# Altium schematic sheet FPGA_PWR.SchDoc
size A3
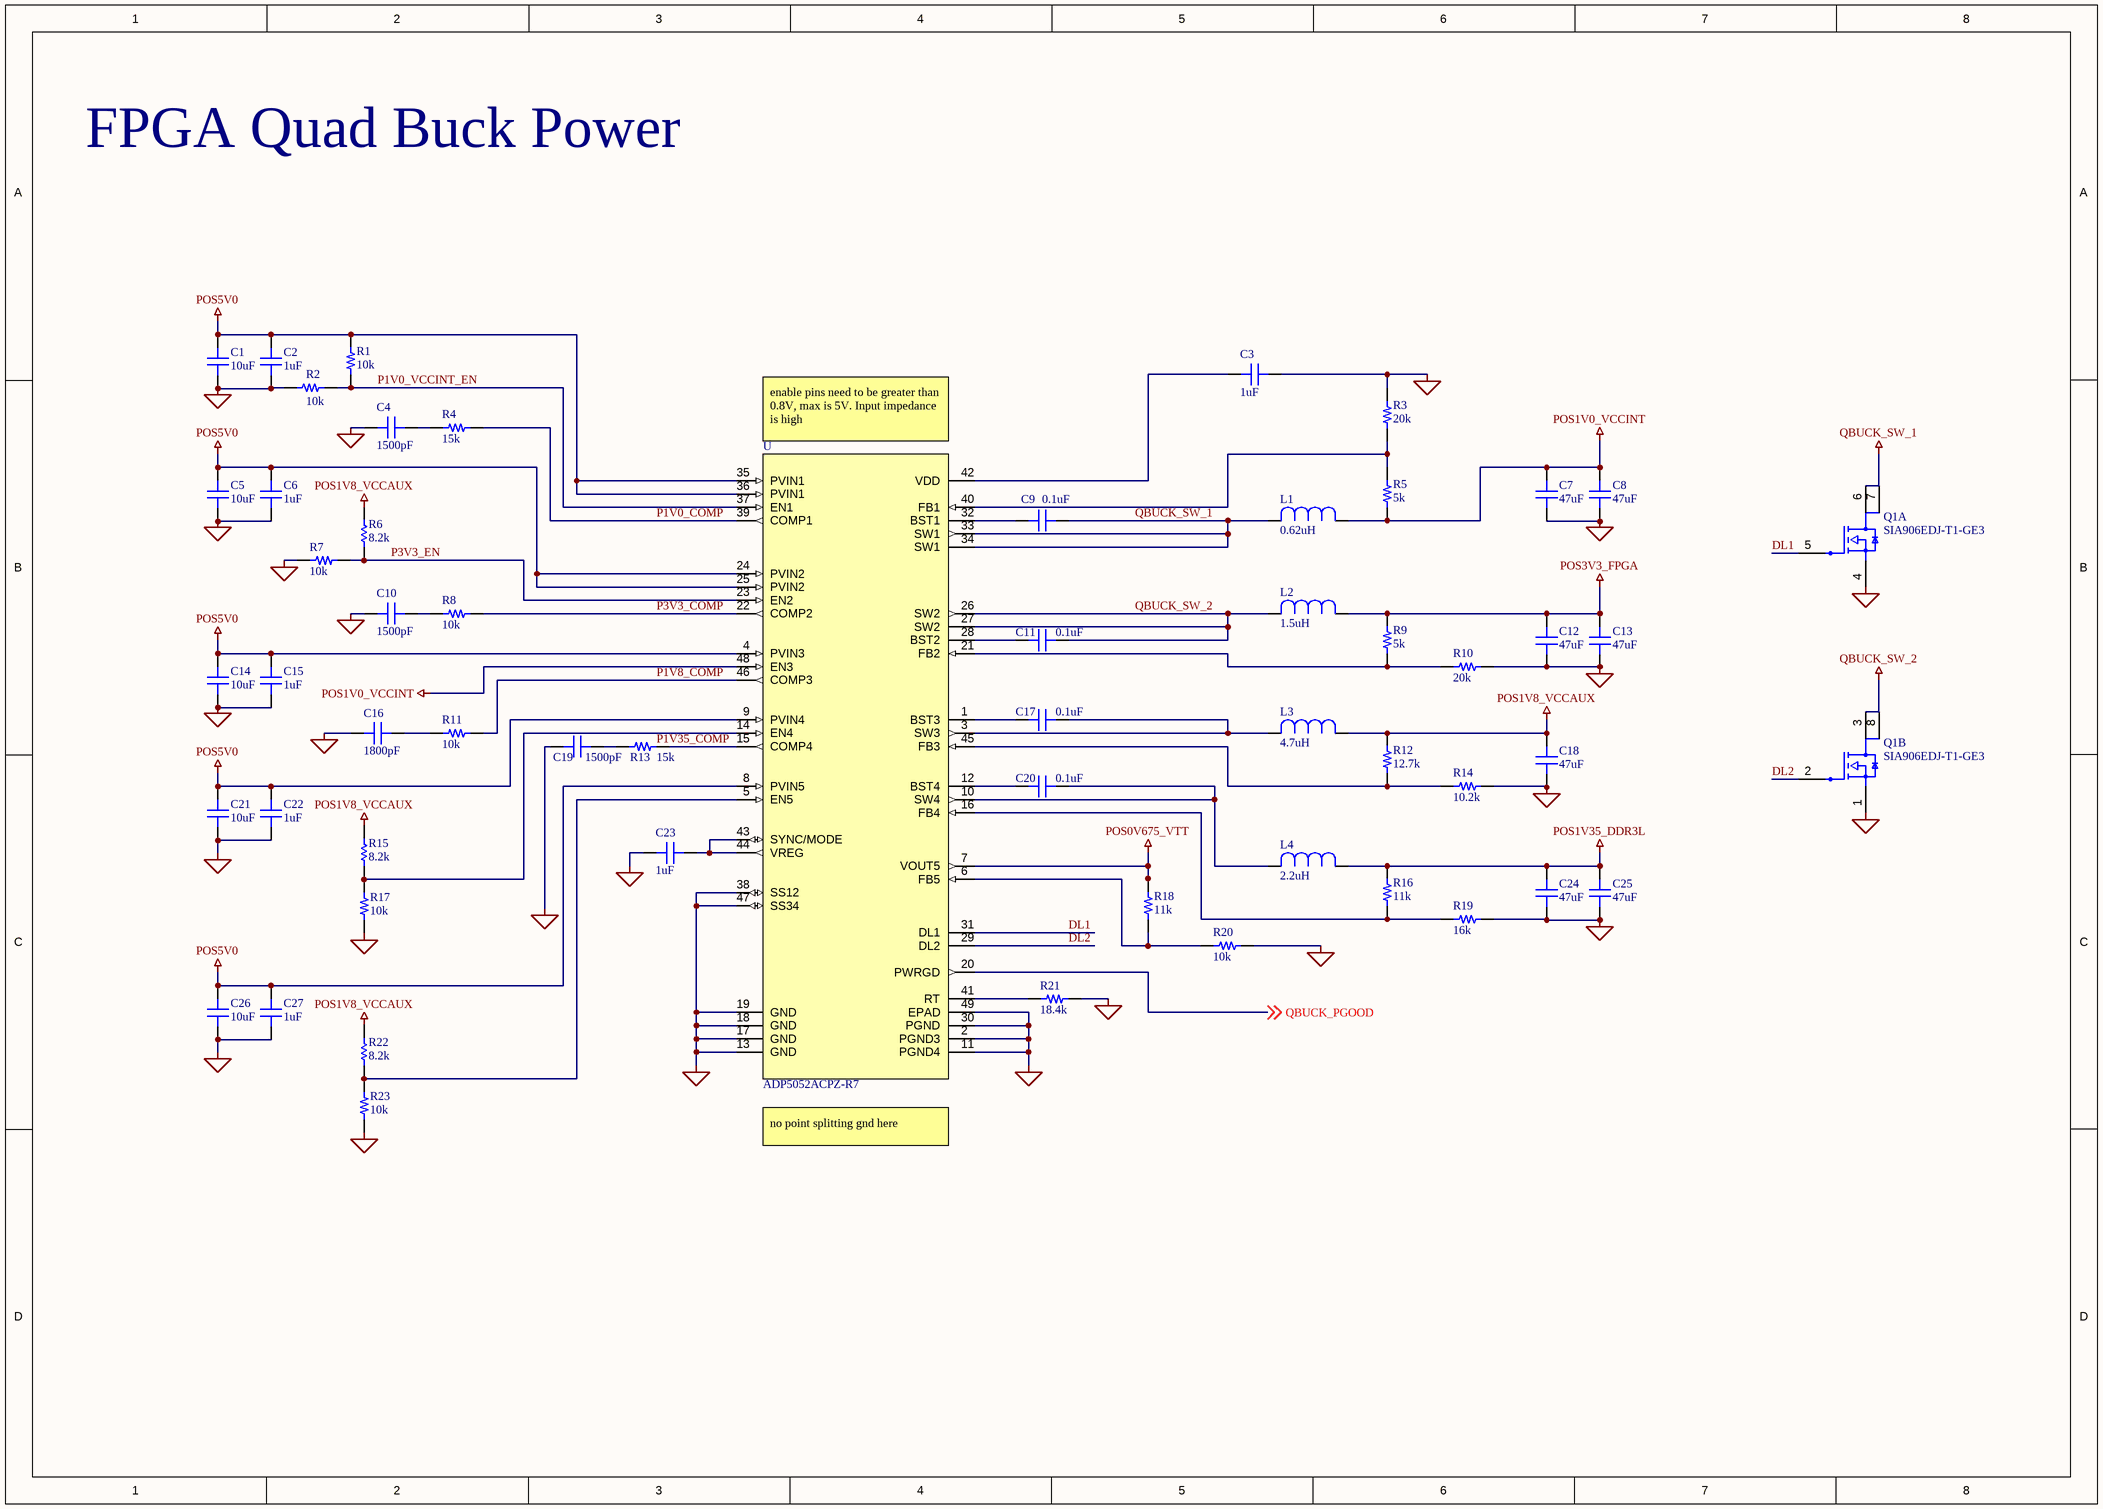
[diagram p0: FPGA_PWR.SchDoc]

## Parts
C1  10uF  [FP-GRM155-0_05-IPC_A]
C2  1uF  [FP-GRM155-0_05-IPC_A]
C3  1uF  [FP-GRM155-0_05-IPC_A]
C4  1500pF  [FP-GRM155-0_05-IPC_A]
C5  10uF  [FP-GRM155-0_05-IPC_A]
C6  1uF  [FP-GRM155-0_05-IPC_A]
C7  47uF  [FP-GCJ21B-0_3-IPC_A]
C8  47uF  [FP-GCJ21B-0_3-IPC_A]
C9  0.1uF  [FP-GRM155-0_05-IPC_A]
C10  1500pF  [FP-GRM155-0_05-IPC_A]
C11  0.1uF  [FP-GRM155-0_05-IPC_A]
C12  47uF  [FP-GCJ21B-0_3-IPC_A]
C13  47uF  [FP-GCJ21B-0_3-IPC_A]
C14  10uF  [FP-GRM155-0_05-IPC_A]
C15  1uF  [FP-GRM155-0_05-IPC_A]
C16  1800pF  [FP-GRM155-0_05-IPC_A]
C17  0.1uF  [FP-GRM155-0_05-IPC_A]
C18  47uF  [FP-GCJ21B-0_3-IPC_A]
C19  1500pF  [FP-GRM155-0_05-IPC_A]
C20  0.1uF  [FP-GRM155-0_05-IPC_A]
C21  10uF  [FP-GRM155-0_05-IPC_A]
C22  1uF  [FP-GRM155-0_05-IPC_A]
C23  1uF  [FP-GRM155-0_05-IPC_A]
C24  47uF  [FP-GCJ21B-0_3-IPC_A]
C25  47uF  [FP-GCJ21B-0_3-IPC_A]
C26  10uF  [FP-GRM155-0_05-IPC_A]
C27  1uF  [FP-GRM155-0_05-IPC_A]
L1  0.62uH  [IND_XGL4030_COC]
L2  1.5uH  [IND_XGL4030_COC]
L3  4.7uH  [IND_XGL4030_COC]
L4  2.2uH  [IND_XGL4030_COC]
Q1  SIA906EDJ-T1-GE3  [FP-C-07431-DUAL-MFG]  (parts A,B of 2)
R1  10k  [RES 0603_1608]
R2  10k  [RES 0603_1608]
R3  20k  [FP-RC0402-IPC_A]
R4  15k  [RES 0603_1608]
R5  5k  [FP-RC0402-IPC_A]
R6  8.2k  [RESC1609X55X30LL15T15]
R7  10k  [RES 0603_1608]
R8  10k  [RES 0603_1608]
R9  5k  [FP-RC0402-IPC_A]
R10  20k  [FP-RC0402-IPC_A]
R11  10k  [RES 0603_1608]
R12  12.7k  [FP-RC0402-IPC_A]
R13  15k  [RES 0603_1608]
R14  10.2k  [FP-RC0402-IPC_A]
R15  8.2k  [RESC1609X55X30LL15T15]
R16  11k  [FP-RC0402-IPC_A]
R17  10k  [RES 0603_1608]
R18  11k  [FP-RC0402-IPC_A]
R19  16k  [FP-RC0402-IPC_A]
R20  10k  [RES 0603_1608]
R21  18.4k  [RES 0603_1608]
R22  8.2k  [RESC1609X55X30LL15T15]
R23  10k  [RES 0603_1608]
U  ADP5052ACPZ-R7  [QFN50P700X700X80-49N]

## Nets
GND: C1.1 C2.1 C3.1 C4.2 C5.1 C6.1 C7.1 C8.1 C10.2 C12.1 C13.1 C14.1 C15.1 C16.2 C18.1 C19.2 C21.1 C22.1 C23.2 C24.1 C25.1 C26.1 C27.1 Q1.1(S1) Q1.4(S1) R2.2 R3.1 R7.2 R10.2 R14.2 R17.2 R19.2 R20.1 R21.1 R23.2 U.2(PGND3) U.11(PGND4) U.13(GND) U.17(GND) U.18(GND) U.19(GND) U.30(PGND) U.38(SS12) U.47(SS34) U.49(EPAD)
POS0V675_VTT: R18.2 U.7(VOUT5)
POS1V0_VCCINT: C7.2 C8.2 L1.1 R5.1 U.48(EN3)
POS1V8_VCCAUX: C18.2 L3.1 R12.2
POS1V35_DDR3L: C24.2 C25.2 L4.1 R16.2
POS3V3_FPGA: C12.2 C13.2 L2.1 R9.2
POS5V0: C1.2 C2.2 C5.2 C6.2 C14.2 C15.2 C21.2 C22.2 C26.2 C27.2 R1.2 U.4(PVIN3) U.8(PVIN5) U.9(PVIN4) U.24(PVIN2) U.25(PVIN2) U.35(PVIN1) U.36(PVIN1)
QBUCK_SW_1: C9.2 L1.2 Q1.6(D1) Q1.7(D1) U.33(SW1) U.34(SW1)
QBUCK_SW_2: C11.2 L2.2 Q1.3(D1) Q1.8(D1) U.26(SW2) U.27(SW2)
DL1: Q1.5(G1) U.31(DL1)
DL2: Q1.2(G1) U.29(DL2)
P1V0_COMP: R4.2 U.39(COMP1)
P1V0_VCCINT_EN: R1.1 R2.1 U.37(EN1)
P1V8_COMP: R11.1 U.46(COMP3)
P3V3_COMP: R8.1 U.22(COMP2)
P3V3_EN: R6.1 R7.1 U.23(EN2)
QBUCK_PGOOD: U.20(PWRGD) ; off-sheet QBUCK_PGOOD
NetC3_2: C3.2 U.42(VDD)
NetC4_1: C4.1 R4.1
NetC9_1: C9.1 U.32(BST1)
NetC10_1: C10.1 R8.2
NetC11_1: C11.1 U.28(BST2)
NetC16_1: C16.1 R11.2
NetC17_1: C17.1 U.1(BST3)
NetC17_2: C17.2 L3.2 U.3(SW3)
NetC19_1: C19.1 R13.1
NetC20_1: C20.1 U.12(BST4)
NetC20_2: C20.2 L4.2 U.10(SW4)
NetC23_1: C23.1 U.43(SYNC/MODE) U.44(VREG)
NetR3_2: R3.2 R5.2 U.40(FB1)
NetR9_1: R9.1 R10.1 U.21(FB2)
NetR12_1: R12.1 R14.1 U.45(FB3)
NetR13_2: R13.2 U.15(COMP4)
NetR15_1: R15.1 R17.1 U.14(EN4)
NetR16_1: R16.1 R19.1 U.16(FB4)
NetR18_1: R18.1 R20.2 U.6(FB5)
NetR21_2: R21.2 U.41(RT)
NetR22_1: R22.1 R23.1 U.5(EN5)

Not connected (* = marked no-connect by the designer): R6 2; R15 2; R22 2

## Notes on the sheet
- FPGA Quad Buck Power
- (near U) enable pins need to be greater than 0.8V, max is 5V. Input impedance is high
- no point splitting gnd here
- Labels drawn without touching a wire or pin: P1V35_COMP, POS1V8_VCCAUX
- THIS DOCUMENT AND THE DATA DISCLOSED HEREIN OR
- HEREWITH IS THE PROPERTY OF ALTIUM LIMITED AND MAY
- DWG NO:
- REVISION
- REV:
- DESCRIPTION
- DATE
- APPROVED
- BE FREELY DISTRIBUTED IN WHOLE. NO RIGHTS ARE
- RESERVED OR EXPRESS OR IMPLIED WARANTEE GIVEN.
- ENG:
- APPROVALS
- PROJECT
- DSN:
- CHK:
- REFERENCE DOCUMENTS
- PROJECT REVISION:
- TITLE
- DOCUMENT REVISION:
- DESIGN ITEM:
- BOM:
- FAB DWG:
- PCB DWG:
- ASSY DWG:
- SCALE:
- A3
- SIZE
- CAGE CODE
- FILE NAME
- DWG NO.
- SHEET
- OF
- REV

## Library data of the parts
C1 C4 C5 C10 C14 C16 C19 C21 C26 = CMP-13271-000002-1: CAP CER 10UF 10V X5R 0402; Manufacturer Part Number: CL05A106MP5NUNC; Manufacturer: Samsung; Temperature Coefficient: 15%; Tolerance: 20%; Material: Ceramic; Octopart: https://octopart.com/cl05a106mp5nunc-samsung-22457395; Voltage Rating: 10V; RoHS: TRUE; Value: 10uF; Height: 0.7mm; Digikey Description: CAP CER 10UF 10V X5R 0402; Automotive: No; Package: CL05A106MP5NUNC; Device Class L1: Passive Components; Capacitance: 10uF; Temperature Range High: +85°C; ComponentLink2Description: Datasheet; Device Class L2: Capacitors; Temperature Characteristic: X5R; Temperature: -55°C to +85°C; ComponentLink2URL: http://www.samsungsem.com/kr/support/product-search/mlcc/__icsFiles/afieldfile/2019/05/10/19-CL05A106MP5NUNC.pdf; Device Class L3: Ceramic Capacitors; Category: Cap; Temperature Range Low: -55°C; Ipc Land Pattern Name: CAPC10050X50; Lead Free: Yes
C2 C3 C6 C15 C22 C23 C27 = CMP-06035-012395-1: Chip Multilayer Ceramic Capacitors for General Purpose, 0402, 1.0uF, X5R, 15%, 20%, 25V; Weight: 0.000212oz; Dielectric: X5R; Case Code (Metric): 1005; Thickness: 0.022inch; Min Operating Temperature: -55°C; Voltage Rating (DC): 25V; Lead Free: Lead Free; Voltage Rating: 25V; Max Operating Temperature: 85°C; Case/Package: 0402; Packaging: Tape and Reel; Package Quantity: 10000; Termination: SMD/SMT; Height: 0.5mm; Width: 0.5mm; Mount: Surface Mount; Case Code (Imperial): 0402; Tolerance: 20%; Capacitance: 1uF; Length: 0.039inch
C7 C8 C12 C13 C18 C24 C25 = CMP-2007-03215-2: Multilayer Ceramic Capacitors MLCC - SMD/SMT 0805 0.47uF 10%, 50VDC,  X7R 15%; Voltage Rating (DC): 50V; Capacitance: 470nF; Case Code (Imperial): 0805; Tolerance: 10%; Length: 0.079inch; Packaging: Tape and Reel; Voltage Rating: 50V; Depth: 1.25mm; Lead Free: Lead Free; Features: Soft Termination; Min Operating Temperature: -55°C; Thickness: 0.057inch; Ratings: AEC-Q200; Case/Package: 0805; Dielectric: X7R; Case Code (Metric): 2012; Mount: Surface Mount; Termination: SMD/SMT; Width: 0.049inch; Max Operating Temperature: 125°C; Package Quantity: 3000
C9 C11 C17 C20 = CMP-06035-012395-1: Chip Multilayer Ceramic Capacitors for General Purpose, 0402, 1.0uF, X5R, 15%, 20%, 25V; Capacitance: 1uF; Weight: 0.000212oz; Dielectric: X5R; Case Code (Metric): 1005; Thickness: 0.022inch; Min Operating Temperature: -55°C; Voltage Rating (DC): 25V; Lead Free: Lead Free; Voltage Rating: 25V; Max Operating Temperature: 85°C; Case/Package: 0402; Packaging: Tape and Reel; Package Quantity: 10000; Termination: SMD/SMT; Height: 0.5mm; Width: 0.5mm; Mount: Surface Mount; Case Code (Imperial): 0402; Tolerance: 20%; Length: 0.039inch
L1-L4 = XGL4030-621MEC: No Description Available; Mfr_Name: Coilcraft
Q1 = CMP-02550-000163-1: MOSFET 2N-CH 20V 4.5A SC70-6; Manufacturer: Vishay; Transconductance: 14S; Rthja Max: 52°C/W; Turn On Delay Time: 5ns; Number Of Channels: 2; Threshold Vgs Max: 1.4V; Input Capacitace At Vds: 350pF @ 10V; Power Dissipation: 1.9W; Threshold Vgs Min: 0.6V; Drain To Source Resistance: 0.037Ω; Reverse Recovery Charge: 8nC; Depletion Mode: False; Turn Off Delay Time: 15ns; Gate Charge At Vgs: 7.5nC @ 10V; Typ Forward Diode Voltage: 0.8V; Gate To Source Voltage: 12V; Pulse Drain Current: 15A; Standoff Height: 0mm; Max Forward Diode Voltage: 1.2V; Max Junction Temp: +150°C; Temperature Range Low: -55°C; Manufacturer Part Number: SIA906EDJ-T1-GE3; Automotive: No; Digikey Description: MOSFET 2N-CH 20V 4.5A SC70-6; Drain To Source Voltage: 20V; Continuous Drain Current: 4.5A; Number Of N Channels: 2; Device Class L2: Transistors; Category: Trans; Footprint Url: https://www.vishay.com/docs/70487/70487.pdf; Device Class L3: MOSFETs; Package: C-07431-DUAL; Octopart: https://octopart.com/sia906edj-t1-ge3-vishay-44597396; ComponentLink2URL: https://www.vishay.com/docs/69067/sia906ed.pdf; Device Class L1: Discrete Semiconductors; Temperature Range High: +150°C; RoHS: TRUE; Reverse Recovery Time: 15ns; Drain To Source Breakdown Voltage: 20V; ComponentLink2Description: Datasheet; Lead Free: Yes; Mouser Description: MOSFET 20V 4.5A 7.8W 46mohm @ 4.5V; Height: 0.85mm; Temperature: -55°C to +150°C
R1 R2 R7 R8 R11 R17 R20 R23 = CMP-009-00190-14: 10 ±1% 0.1W, 1/10W Chip Resistor 0603 (1608 Metric) Automotive AEC-Q200 Thick Film; Power Rating: 100mW; Voltage Rating: 75V; Temperature Coefficient: 100ppm/°C; Tolerance: 1%; Resistance: 10k; Case/Package: 0603
R3 R10 = CMP-03412-013078-1: RES SMD 20K OHM 1% 1/16W 0402; Manufacturer: Yageo; Manufacturer Part Number: RC0402FR-075KL; Resistance: 5kΩ; Temperature Coefficient: 100ppm/°C; Power Rating: 0.0625W; Voltage Rating: 50V; Value: 5kΩ; Temperature Range Low: -55°C; Lead Free: Yes; RoHS: TRUE; Device Class L2: Resistors; Package: RC0402; Footprint Url: https://pccomponents.com/datasheets/YAGEO-20RESISTORS.PDF; Height: 0.4mm; ComponentLink2URL: http://www.yageo.com/documents/recent/PYu-RC_Group_51_RoHS_L_10.pdf; Temperature: -55°C to +155°C; Composition: Thick Film; Device Class L1: Passive Components; Series: RC_L; Ipc Land Pattern Name: RESC10050X35; Tolerance: 1%; Device Class L3: Chip SMD Resistors; Temperature Range High: +155°C; Category: Res; Automotive: No; Octopart: https://octopart.com/rc0402fr-075kl-yageo-25450038; Digikey Description: RES SMD 5K OHM 1% 1/16W 0402; ComponentLink2Description: Datasheet
R4 R13 = CMP-010-0035-11: 15 kOhms ±1% 0.1W, 1/10W Chip Resistor 0603 (1608 Metric) Moisture Resistant Thick Film; Power Rating: 100mW; Temperature Coefficient: 100ppm/°C; Voltage Rating: 75V; Tolerance: 1%; Resistance: 15k; Case/Package: 0603
R5 R9 R12 R14 R16 R18 R19 = CMP-03412-013078-1: RES SMD 5K OHM 1% 1/16W 0402; Manufacturer: Yageo; Manufacturer Part Number: RC0402FR-075KL; Resistance: 5kΩ; Temperature Coefficient: 100ppm/°C; Power Rating: 0.0625W; Voltage Rating: 50V; Value: 5kΩ; Temperature Range Low: -55°C; Lead Free: Yes; RoHS: TRUE; Device Class L2: Resistors; Package: RC0402; Footprint Url: https://pccomponents.com/datasheets/YAGEO-20RESISTORS.PDF; Height: 0.4mm; ComponentLink2URL: http://www.yageo.com/documents/recent/PYu-RC_Group_51_RoHS_L_10.pdf; Temperature: -55°C to +155°C; Composition: Thick Film; Device Class L1: Passive Components; Series: RC_L; Ipc Land Pattern Name: RESC10050X35; Tolerance: 1%; Device Class L3: Chip SMD Resistors; Temperature Range High: +155°C; Category: Res; Automotive: No; Octopart: https://octopart.com/rc0402fr-075kl-yageo-25450038; Digikey Description: RES SMD 5K OHM 1% 1/16W 0402; ComponentLink2Description: Datasheet
R6 R15 R22 = CMP-1012-00613-3: Chip Resistor, 8.2 KOhm, +/- 1%, 0.1 W, -55 to 155 degC, 0603 (1608 Metric), RoHS, Tape and Reel; Nominal Supply Current: 300 uA; Common Mode Rejection Ratio: 58 dB; Channels: 1; Case\Package: SOT-23-5; Nominal Gain Bandwith Product: 3.7 MHz; Max Supply Voltage: 5.25 V; Slew Rate: 3 V\us; Min Supply Voltage: 2.3 V; Nominal Voltage Gain: 102 dB; Nominal Supply Voltage: 3 V; Width: 1.7 mm; Length: 3 mm; Max Operating Temperature: 85 degC; Height: 1.3 mm; ComponentLink2Description: Datasheet; ComponentLink1URL: http://www.panasonic.com/; PackageDescription: 2-Pin Surface Mount Device, Body 1.6 x 0.85 mm; PackageReference: 0603; Radiation Hardening: No; Min Operating Temperature: -40 degC; Package Quantity: 3000; Bandwidth: 3.7 MHz; ComponentLink1Description: Manufacturer URL; Packaging: Tape and Reel; Mount: Surface Mount; ComponentLink2URL: http://industrial.panasonic.com/cdbs/www-data/pdf/RDA0000/AOA0000C86.pdf; RoHSCompliant: true; DatasheetVersion: Apr-15; REACH SVHC: No SVHC; Unity Gain Bandwidth Product: 3.7 MHz; Pins: 5
R21 = CMP-009-00190-14: 10 ±1% 0.1W, 1/10W Chip Resistor 0603 (1608 Metric) Automotive AEC-Q200 Thick Film; Power Rating: 100mW; Resistance: 10k; Voltage Rating: 75V; Temperature Coefficient: 100ppm/°C; Tolerance: 1%; Case/Package: 0603
U = ADP5052ACPZ-R7: PMIC - Voltage Regulators - Linear + Switching 5 Output Step-Down _Buck_ Synchronous _4_, Linear _LDO_ _1_ 740kHz 48-LFCSP-WQ _7x7_; MF: Analog Devices; Price: None; Value: *; MP: ADP5052ACPZ-R7; Package: LFCSP -48 Analog Devices; SnapEDA_Link: https://www.snapeda.com/parts/ADP5052ACPZ-R7/Analog%20Devices%20Inc./view-part/478810/?ref=snap; Availability: Unavailable